# EAGLE design sch (EAGLE 8.4.0)
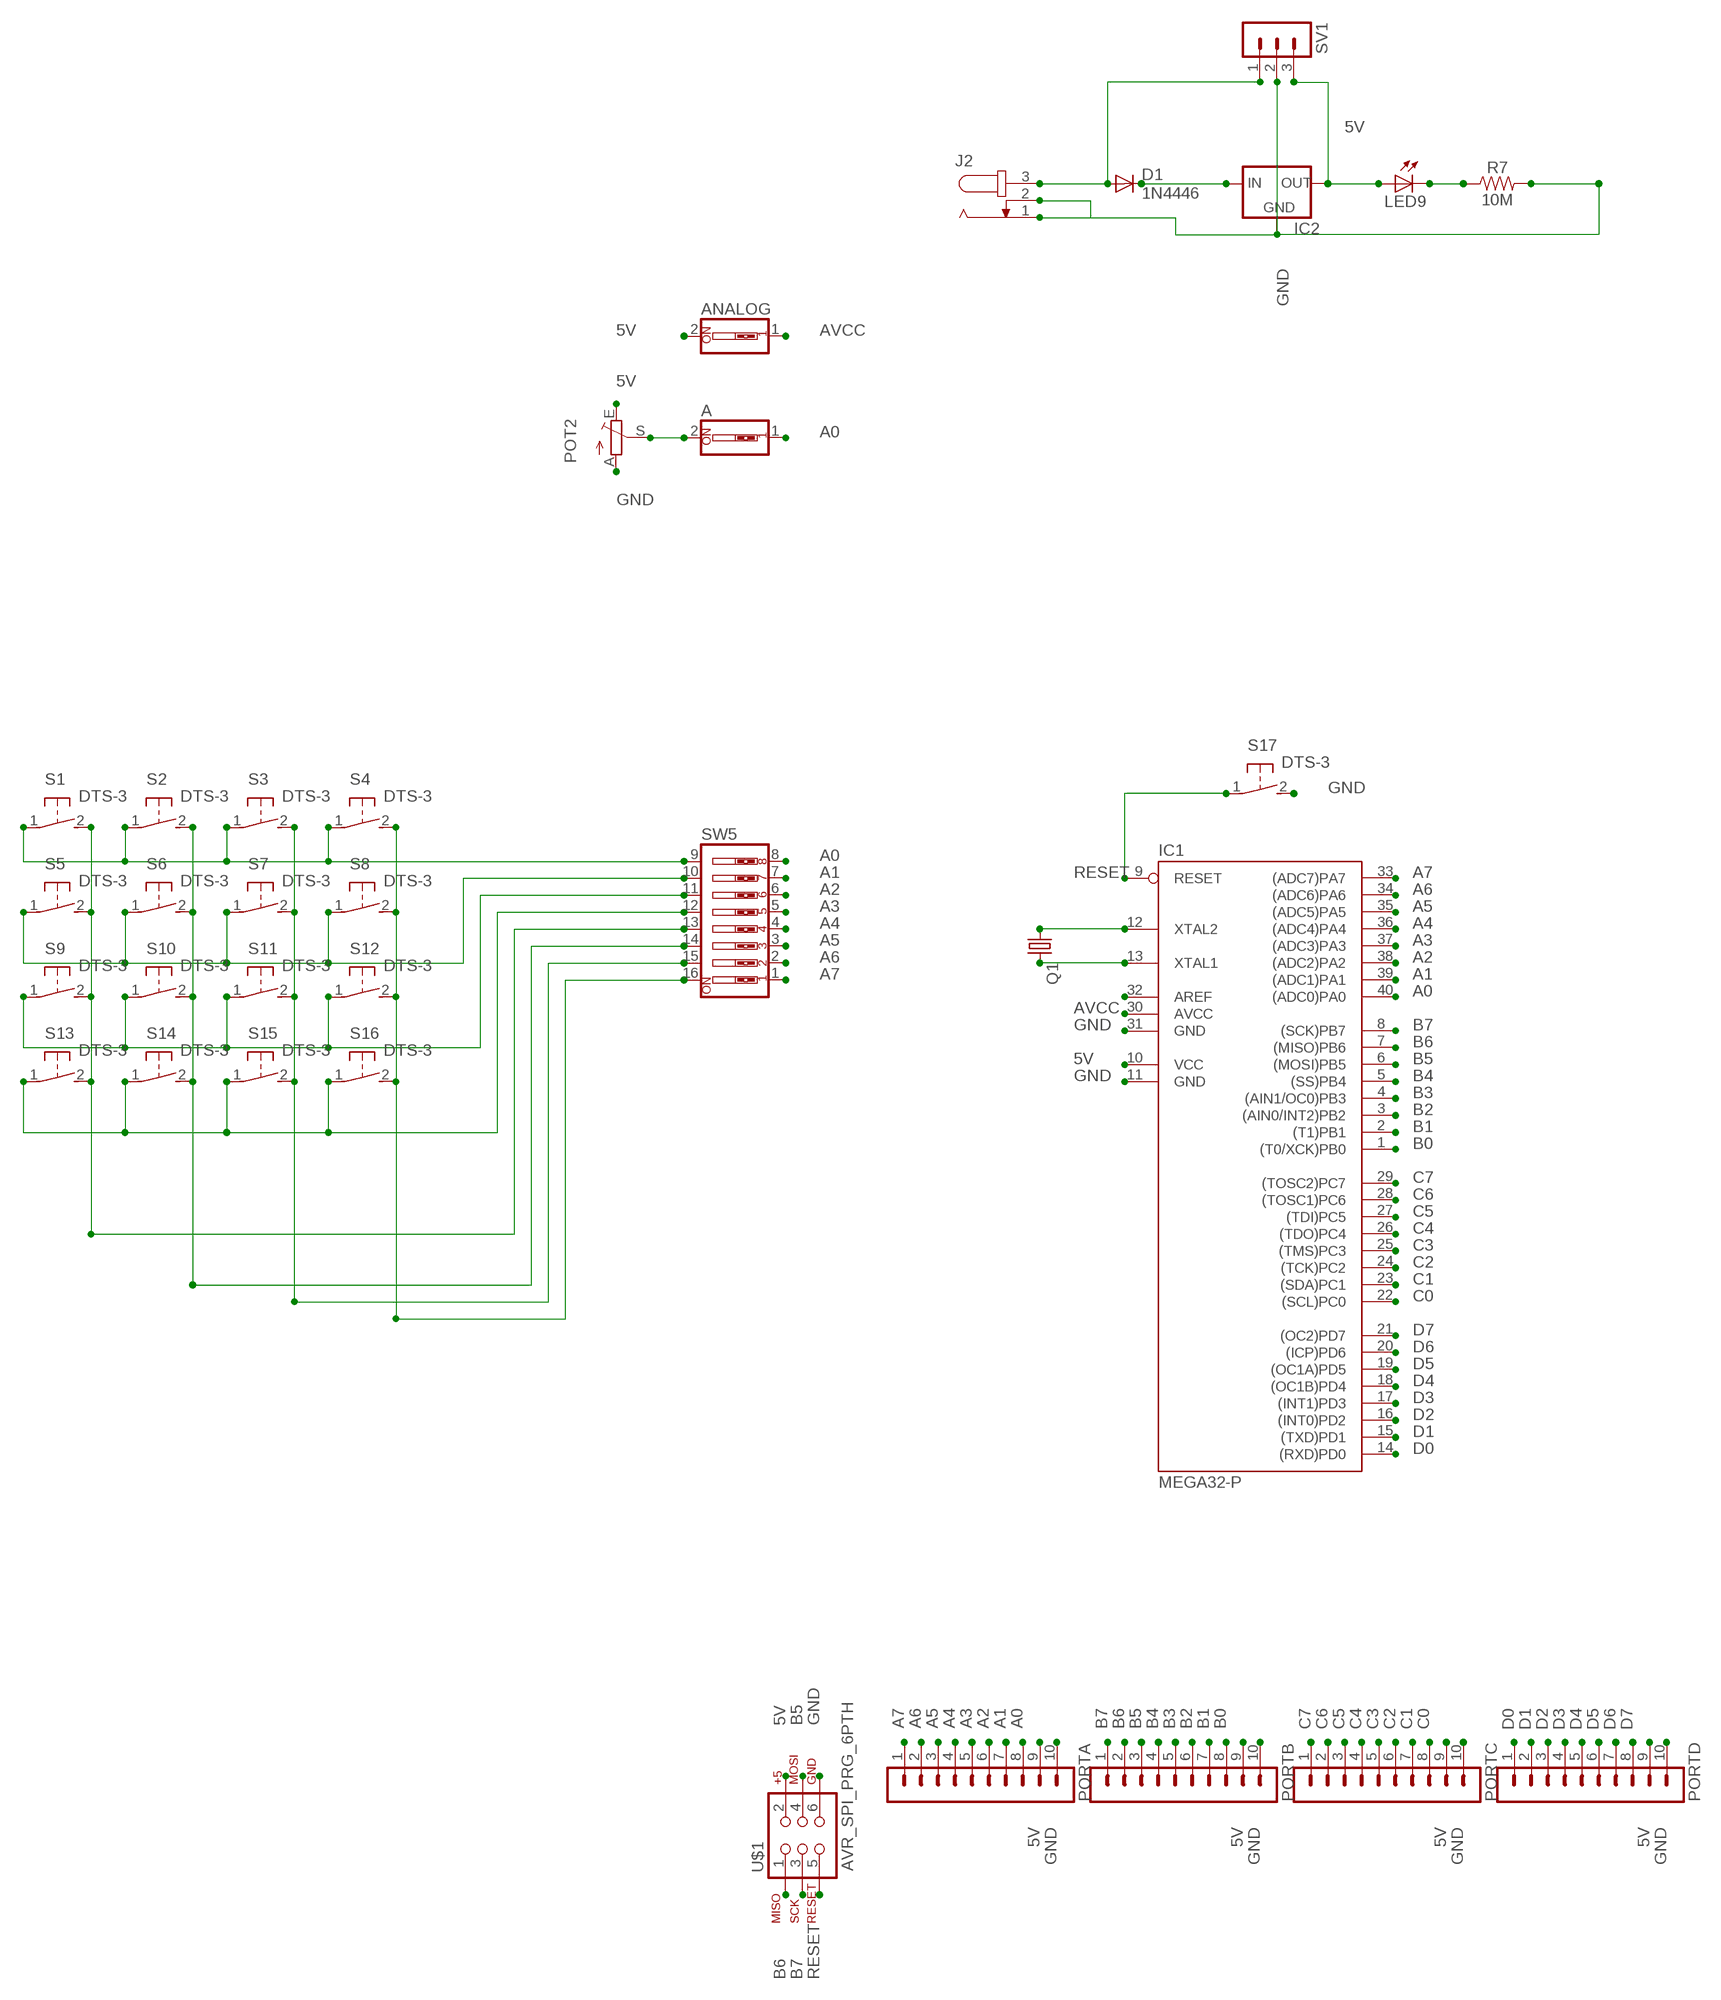
[diagram p0: schematic, sheet 1, part 1 of 2]
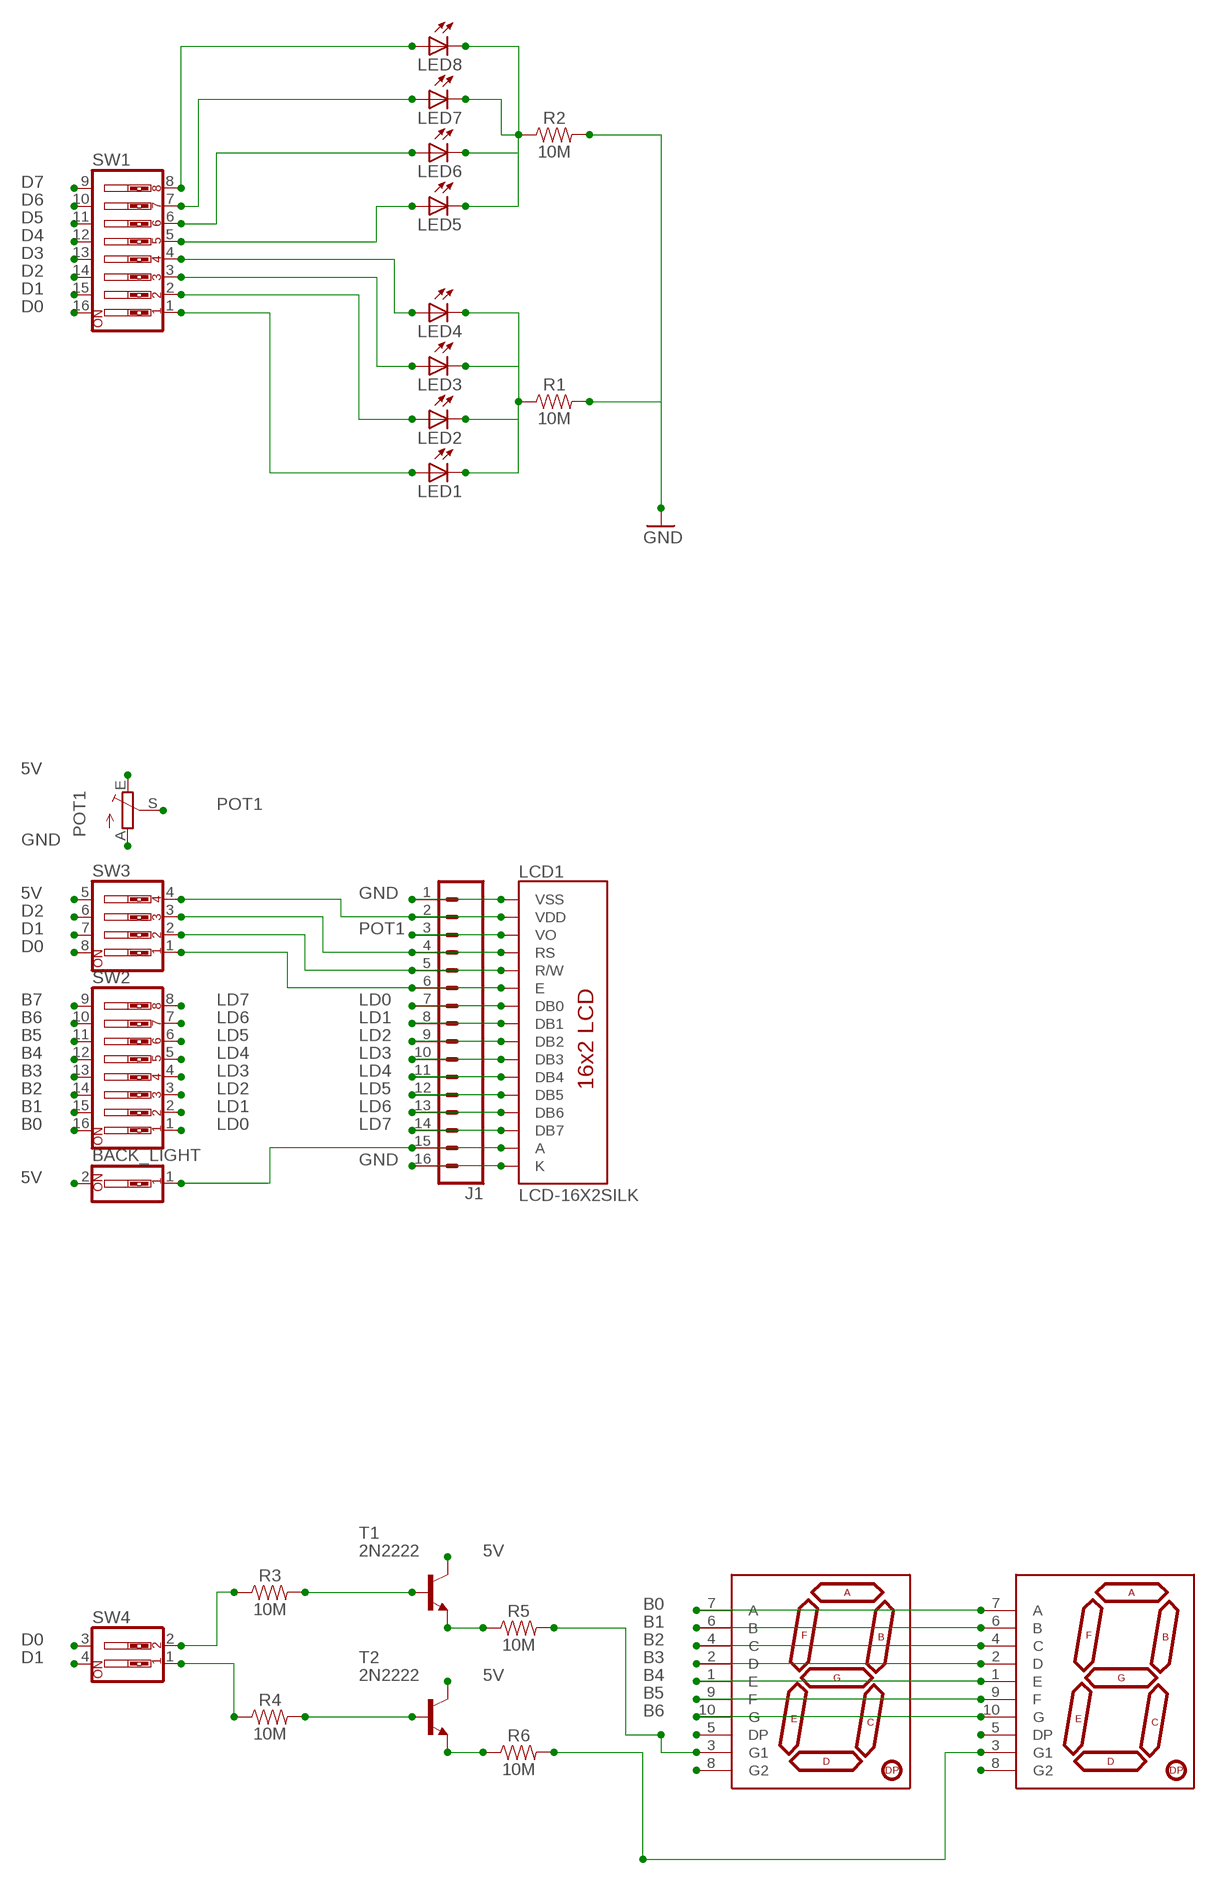
[diagram p1: schematic, sheet 1, part 2 of 2]

## Parts
A  SW_DIP-1  [EDG-01]
ANALOG  SW_DIP-1  [EDG-01]
BACK_LIGHT  SW_DIP-1  [EDG-01]
D1  1N4446  [DO35-10]
IC1  MEGA32-P  [DIL40]
IC2  78MXXL  [78MXXL]
J1  CONN_16LONGPADS  [1X16_LONGPADS]
J2  JACK-PLUG0  [SPC4077]
LCD1  LCD-16X2SILK  [LCD-16X2]
LED1  LED5MM  [LED5MM]
LED2  LED5MM  [LED5MM]
LED3  LED5MM  [LED5MM]
LED4  LED5MM  [LED5MM]
LED5  LED5MM  [LED5MM]
LED6  LED5MM  [LED5MM]
LED7  LED5MM  [LED5MM]
LED8  LED5MM  [LED5MM]
LED9  LED5MM  [LED5MM]
PORTA  MA10-1  [MA10-1]
PORTB  MA10-1  [MA10-1]
PORTC  MA10-1  [MA10-1]
PORTD  MA10-1  [MA10-1]
POT1  TRIM_EU-B25P  [B25P]
POT2  TRIM_EU-B25P  [B25P]
Q1  CRYTALHC49U-V  [HC49U-V]
R1  10M  10MOHM-HORIZ-1/4W-5%  [AXIAL-0.3]
R2  10M  10MOHM-HORIZ-1/4W-5%  [AXIAL-0.3]
R3  10M  10MOHM-HORIZ-1/4W-5%  [AXIAL-0.3]
R4  10M  10MOHM-HORIZ-1/4W-5%  [AXIAL-0.3]
R5  10M  10MOHM-HORIZ-1/4W-5%  [AXIAL-0.3]
R6  10M  10MOHM-HORIZ-1/4W-5%  [AXIAL-0.3]
R7  10M  10MOHM-HORIZ-1/4W-5%  [AXIAL-0.3]
S1  DTS-3  [DTS-3]
S2  DTS-3  [DTS-3]
S3  DTS-3  [DTS-3]
S4  DTS-3  [DTS-3]
S5  DTS-3  [DTS-3]
S6  DTS-3  [DTS-3]
S7  DTS-3  [DTS-3]
S8  DTS-3  [DTS-3]
S9  DTS-3  [DTS-3]
S10  DTS-3  [DTS-3]
S11  DTS-3  [DTS-3]
S12  DTS-3  [DTS-3]
S13  DTS-3  [DTS-3]
S14  DTS-3  [DTS-3]
S15  DTS-3  [DTS-3]
S16  DTS-3  [DTS-3]
S17  DTS-3  [DTS-3]
SV1  MA03-1  [MA03-1]
SW1  SW_DIP-8  [EDG-08]
SW2  SW_DIP-8  [EDG-08]
SW3  SW_DIP-4  [EDG-04]
SW4  SW_DIP-2  [DIPSWITCH-02]
SW5  SW_DIP-8  [EDG-08]
T1  2N2222  [TO92-EBC-OVAL]
T2  2N2222  [TO92-EBC-OVAL]
U$1  AVR_SPI_PRG_6PTH  [2X3]
U$2  YSD-160AB3C-8  7-SEGMENT-1DIGIT-1INCH-BLUE-EZ  [7-SEGMENT-1"PTH-EZ]
U$3  YSD-160AB3C-8  7-SEGMENT-1DIGIT-1INCH-BLUE-EZ  [7-SEGMENT-1"PTH-EZ]

## Nets
5V: ANALOG.2 BACK_LIGHT.2 IC1.10(VCC) IC2.OUT LED9.A PORTA.9 PORTB.9 PORTC.9 PORTD.9 POT1.E POT2.E SV1.3 SW3.5 T1.C T2.C U$1.2
A0: A.1 IC1.40((ADC0)PA0) PORTA.8 SW5.8
A1: IC1.39((ADC1)PA1) PORTA.7 SW5.7
A2: IC1.38((ADC2)PA2) PORTA.6 SW5.6
A3: IC1.37((ADC3)PA3) PORTA.5 SW5.5
A4: IC1.36((ADC4)PA4) PORTA.4 SW5.4
A5: IC1.35((ADC5)PA5) PORTA.3 SW5.3
A6: IC1.34((ADC6)PA6) PORTA.2 SW5.2
A7: IC1.33((ADC7)PA7) PORTA.1 SW5.1
AVCC: ANALOG.1 IC1.30(AVCC)
B0: IC1.1((T0/XCK)PB0) PORTB.8 SW2.16 U$2.7(A) U$3.7(A)
B1: IC1.2((T1)PB1) PORTB.7 SW2.15 U$2.6(B) U$3.6(B)
B2: IC1.3((AIN0/INT2)PB2) PORTB.6 SW2.14 U$2.4(C) U$3.4(C)
B3: IC1.4((AIN1/OC0)PB3) PORTB.5 SW2.13 U$2.2(D) U$3.2(D)
B4: IC1.5((SS)PB4) PORTB.4 SW2.12 U$2.1(E) U$3.1(E)
B5: IC1.6((MOSI)PB5) PORTB.3 SW2.11 U$1.4 U$2.9(F) U$3.9(F)
B6: IC1.7((MISO)PB6) PORTB.2 SW2.10 U$1.1 U$2.10(G) U$3.10(G)
B7: IC1.8((SCK)PB7) PORTB.1 SW2.9 U$1.3
C0: IC1.22((SCL)PC0) PORTC.8
C1: IC1.23((SDA)PC1) PORTC.7
C2: IC1.24((TCK)PC2) PORTC.6
C3: IC1.25((TMS)PC3) PORTC.5
C4: IC1.26((TDO)PC4) PORTC.4
C5: IC1.27((TDI)PC5) PORTC.3
C6: IC1.28((TOSC1)PC6) PORTC.2
C7: IC1.29((TOSC2)PC7) PORTC.1
D0: IC1.14((RXD)PD0) PORTD.1 SW1.16 SW3.8 SW4.3
D1: IC1.15((TXD)PD1) PORTD.2 SW1.15 SW3.7 SW4.4
D2: IC1.16((INT0)PD2) PORTD.3 SW1.14 SW3.6
D3: IC1.17((INT1)PD3) PORTD.4 SW1.13
D4: IC1.18((OC1B)PD4) PORTD.5 SW1.12
D5: IC1.19((OC1A)PD5) PORTD.6 SW1.11
D6: IC1.20((ICP)PD6) PORTD.7 SW1.10
D7: IC1.21((OC2)PD7) PORTD.8 SW1.9
GDHJH: R4.P$1 SW4.1
GFHGV: R3.P$1 SW4.2
GND: IC1.11(GND) IC1.31(GND) IC2.GND J1.1 J1.16 J2.1 J2.2 LCD1.1(VSS) LCD1.16(K) PORTA.10 PORTB.10 PORTC.10 PORTD.10 POT1.A POT2.A R1.P$2 R2.P$2 R7.P$2 S17.2 SV1.2 U$1.6
LD0: J1.7 LCD1.7(DB0) SW2.1
LD1: J1.8 LCD1.8(DB1) SW2.2
LD2: J1.9 LCD1.9(DB2) SW2.3
LD3: J1.10 LCD1.10(DB3) SW2.4
LD4: J1.11 LCD1.11(DB4) SW2.5
LD5: J1.12 LCD1.12(DB5) SW2.6
LD6: J1.13 LCD1.13(DB6) SW2.7
LD7: J1.14 LCD1.14(DB7) SW2.8
N$1: LED1.K(C) LED2.K(C) LED3.K(C) LED4.K(C) R1.P$1
N$2: U$2.8(G2)
N$3: R6.P$2 U$3.3(G1)
N$4: R3.P$2 T1.B
N$5: J1.4 LCD1.4(RS) SW3.3
N$6: J1.5 LCD1.5(R/W) SW3.2
N$7: J1.6 LCD1.6(E) SW3.1
N$8: LED5.K(C) LED6.K(C) LED7.K(C) LED8.K(C) R2.P$1
N$9: D1.A J2.3 SV1.1
N$10: R5.P$1 T1.E
N$11: R6.P$1 T2.E
N$12: S1.2 S5.2 S9.2 S13.2 SW5.13
N$13: U$3.5(DP)
N$14: IC1.13(XTAL1) Q1.2
N$15: U$3.8(G2)
N$16: R4.P$2 T2.B
N$17: LED8.A SW1.8
N$18: LED7.A SW1.7
N$19: LED6.A SW1.6
N$20: LED5.A SW1.5
N$21: LED4.A SW1.4
N$22: LED3.A SW1.3
N$23: LED2.A SW1.2
N$24: LED1.A SW1.1
N$25: BACK_LIGHT.1 J1.15 LCD1.15(A)
N$27: S2.2 S6.2 S10.2 S14.2 SW5.14
N$28: R5.P$2 U$2.3(G1)
N$29: A.2 POT2.S
N$30: S3.2 S7.2 S11.2 S15.2 SW5.15
N$31: S1.1 S2.1 S3.1 S4.1 SW5.9
N$32: U$2.5(DP)
N$33: D1.C IC2.IN
N$34: S4.2 S8.2 S12.2 S16.2 SW5.16
N$35: IC1.12(XTAL2) Q1.1
N$36: IC1.32(AREF)
N$39: LED9.K(C) R7.P$1
N$41: S5.1 S6.1 S7.1 S8.1 SW5.10
N$49: S9.1 S10.1 S11.1 S12.1 SW5.11
N$57: S13.1 S14.1 S15.1 S16.1 SW5.12
POT1: J1.3 LCD1.3(VO) POT1.S
RESET: IC1.9(RESET) S17.1 U$1.5
RRR: J1.2 LCD1.2(VDD) SW3.4

## Library data of the parts
A ANALOG BACK_LIGHT = special:SW_DIP-1: DIP SWITCH
D1 = diode:1N4446: DIODE high speed (Philips)
IC1 = atmel:MEGA32-P: MICROCONTROLLER 32 Kbytes FLASH 2 Kbytes SRAM 1 Kbytes EEPROM USART 8-channel 10 bit ADC Source: www.atmel.com .. doc2503.pdf; MPN: ATMEGA32-16PU; OC_FARNELL: 1661729; OC_NEWARK: 51P1794
IC2 = v-reg:78MXXL: VOLTAGE REGULATOR
J1 = SparkFun-Connectors:CONN_16: Multi connection point. Often used as Generic Header-pin footprint for 0.1 inch spaced/style header connections On any of the 0.1 inch spaced packages, you can populate with these: Break Away Headers - Straight <https://www.sparkfun.com/products/116> (PRT-00116) Break Away Male Headers - Right Angle <https://www.sparkfun.com/products/553> (PRT-00553) Female Headers <https://www.sparkfun.com/products/115> (PRT-00115) Break Away Headers - Machine Pin <https://www.sparkfun.com/products/117> (PRT-00117) Break Away Female Headers - Swiss Machine Pin <https://www.sparkfun.com/products/743> (PRT-00743) For SCREWTERMINALS and SPRING TERMINALS visit here: Screw Terimnals on SparkFun.com <https://www.sparkfun.com/search/results?term=Screw+Terminals> (5mm/3.5mm/2.54mm spacing) This device is also useful as a general connection point to wire up your design to another part of your project. Our various solder wires solder well into these plated through hole pads. Hook-Up Wire - Assortment (Stranded, 22 AWG) <https://www.sparkfun.com/products/11375> (PRT-11375) Hook-Up Wire - Assortment (Solid Core, 22 AWG) <https://www.sparkfun.com/products/11367> (PRT-11367) View the entire wire category on our website here <https://www.sparkfun.com/categories/141> Special notes: Molex polarized connector foot print use with SKU : PRT-08231 with associated crimp pins and housings. 1MM SMD Version SKU: PRT-10208 NOTES ON THE VARIANTS LOCK and LOCK_LONGPADS... This footprint was designed to help hold the alignment of a through-hole component (i.e. 6-pin header) while soldering it into place. You may notice that each hole has been shifted either up or down by 0.005 of an inch from it's more standard position (which is a perfectly straight line). This slight alteration caused the pins (the squares in the middle) to touch the edges of the holes. Because they are alternating, it causes a "brace" to hold the component in place. 0.005 has proven to be the perfect amount of "off-center" position when using our standard breakaway headers. Although looks a little odd when you look at the bare footprint, once you have a header in there, the alteration is very hard to notice. Also,if you push a header all the way into place, it is covered up entirely on the bottom side.
J2 = con-jack:JACK-PLUG: DC POWER JACK Power Jack, DC, Right Angle, Through Hole, Rated 5A at 16VDC, PC Terminals Distributor: Farnell (www.Farnell.de) Drawing: 84N1161.pdf / 84N1162.pdf Manufacturer: SPC Technology (www.spctechnology.com) Type: SPC4077 / SPC 4078; OC_FARNELL: unknown; OC_NEWARK: unknown
LCD1 = SparkFun-Displays:LCD-16X2: Standard text-only 16x2 parallel input LCD Basic 16 character by 2 line display. Typically utilizes the extremely common HD44780 parallel interface chipset SparkFun Products: Basic 16x2 Green <https://www.sparkfun.com/products/255> Basic 8x2 Green <https://www.sparkfun.com/products/11122>; SF_ID: LCD-00255
LED1-LED9 = led:LED: LED OSRAM: - CHIPLED LG R971, LG N971, LY N971, LG Q971, LY Q971, LO R971, LY R971 LH N974, LH R974 LS Q976, LO Q976, LY Q976 LO Q996 - Hyper CHIPLED LW Q18S LB Q993, LB Q99A, LB R99A - SideLED LS A670, LO A670, LY A670, LG A670, LP A670 LB A673, LV A673, LT A673, LW A673 LH A674 LY A675 LS A676, LA A676, LO A676, LY A676, LW A676 LS A679, LY A679, LG A679 - Hyper Micro SIDELED® LS Y876, LA Y876, LO Y876, LY Y876 LT Y87S - SmartLED LW L88C, LW L88S LB L89C, LB L89S, LG L890 LS L89K, LO L89K, LY L89K LS L896, LA L896, LO L896, LY L896 - TOPLED LS T670, LO T670, LY T670, LG T670, LP T670 LSG T670, LSP T670, LSY T670, LOP T670, LYG T670 LG T671, LOG T671, LSG T671 LB T673, LV T673, LT T673, LW T673 LH T674 LS T676, LA T676, LO T676, LY T676, LB T676, LH T676, LSB T676, LW T676 LB T67C, LV T67C, LT T67C, LS T67K, LO T67K, LY T67K, LW E67C LS E67B, LA E67B, LO E67B, LY E67B, LB E67C, LV E67C, LT E67C LW T67C LS T679, LY T679, LG T679 LS T770, LO T770, LY T770, LG T770, LP T770 LB T773, LV T773, LT T773, LW T773 LH T774 LS E675, LA E675, LY E675, LS T675 LS T776, LA T776, LO T776, LY T776, LB T776 LHGB T686 LT T68C, LB T68C - Hyper Mini TOPLED® LB M676 - Mini TOPLED Santana® LG M470 LS M47K, LO M47K, LY M47K Source: http://www.osram.convergy.de/
PORTA PORTB PORTC PORTD = con-lstb:MA10-1: PIN HEADER; OC_FARNELL: unknown; OC_NEWARK: unknown
POT1 POT2 = pot:TRIM_EU-: POTENTIOMETER
Q1 = crystal:CRYTAL: CRYSTAL
R1-R7 = SparkFun-Resistors:10MOHM: RES-09327; PROD_ID: RES-09327
S1-S17 = switch-tact:DTS-3
SV1 = con-lstb:MA03-1: PIN HEADER; OC_FARNELL: unknown; OC_NEWARK: unknown
SW1 SW2 SW5 = special:SW_DIP-8: DIP SWITCH
SW3 = special:SW_DIP-4: DIP SWITCH
SW4 = SparkFun:SW_DIP-2: DIP SWITCH
T1 T2 = adafruit:2N2222: NPN TRANSISTOR Big oval pads
U$1 = SparkFun:AVR_SPI_PRG_6: AVR ISP 6 Pin This is the reduced ISP connector for AVR programming. Common on Arduino. This footprint will take up less PCB space and can be used with a 10-pin to 6-pin adapter such as SKU: BOB-08508
U$2 U$3 = SparkFun-LED:7-SEGMENT-1DIGIT-1INCH: 7-Segment Display, single digit, 1" EZ is for kits. Pads are only exposed on the bottom side to help prevent soldering in upside down. Datasheet (Red) <https://cdn.sparkfun.com/datasheets/Components/LED/YSD-160AR4B-8.pdf> Datasheet (Blue) <https://cdn.sparkfun.com/datasheets/Components/LED/YSD-160AB3C-8.pdf> SparkFun Products 7-Segment Display - LED (Red) <https://www.sparkfun.com/products/8546> (COM-08546) 7-Segment Display - LED (Blue) <https://www.sparkfun.com/products/9191> (COM-09191); PROD_ID: COMP-09495

## Board
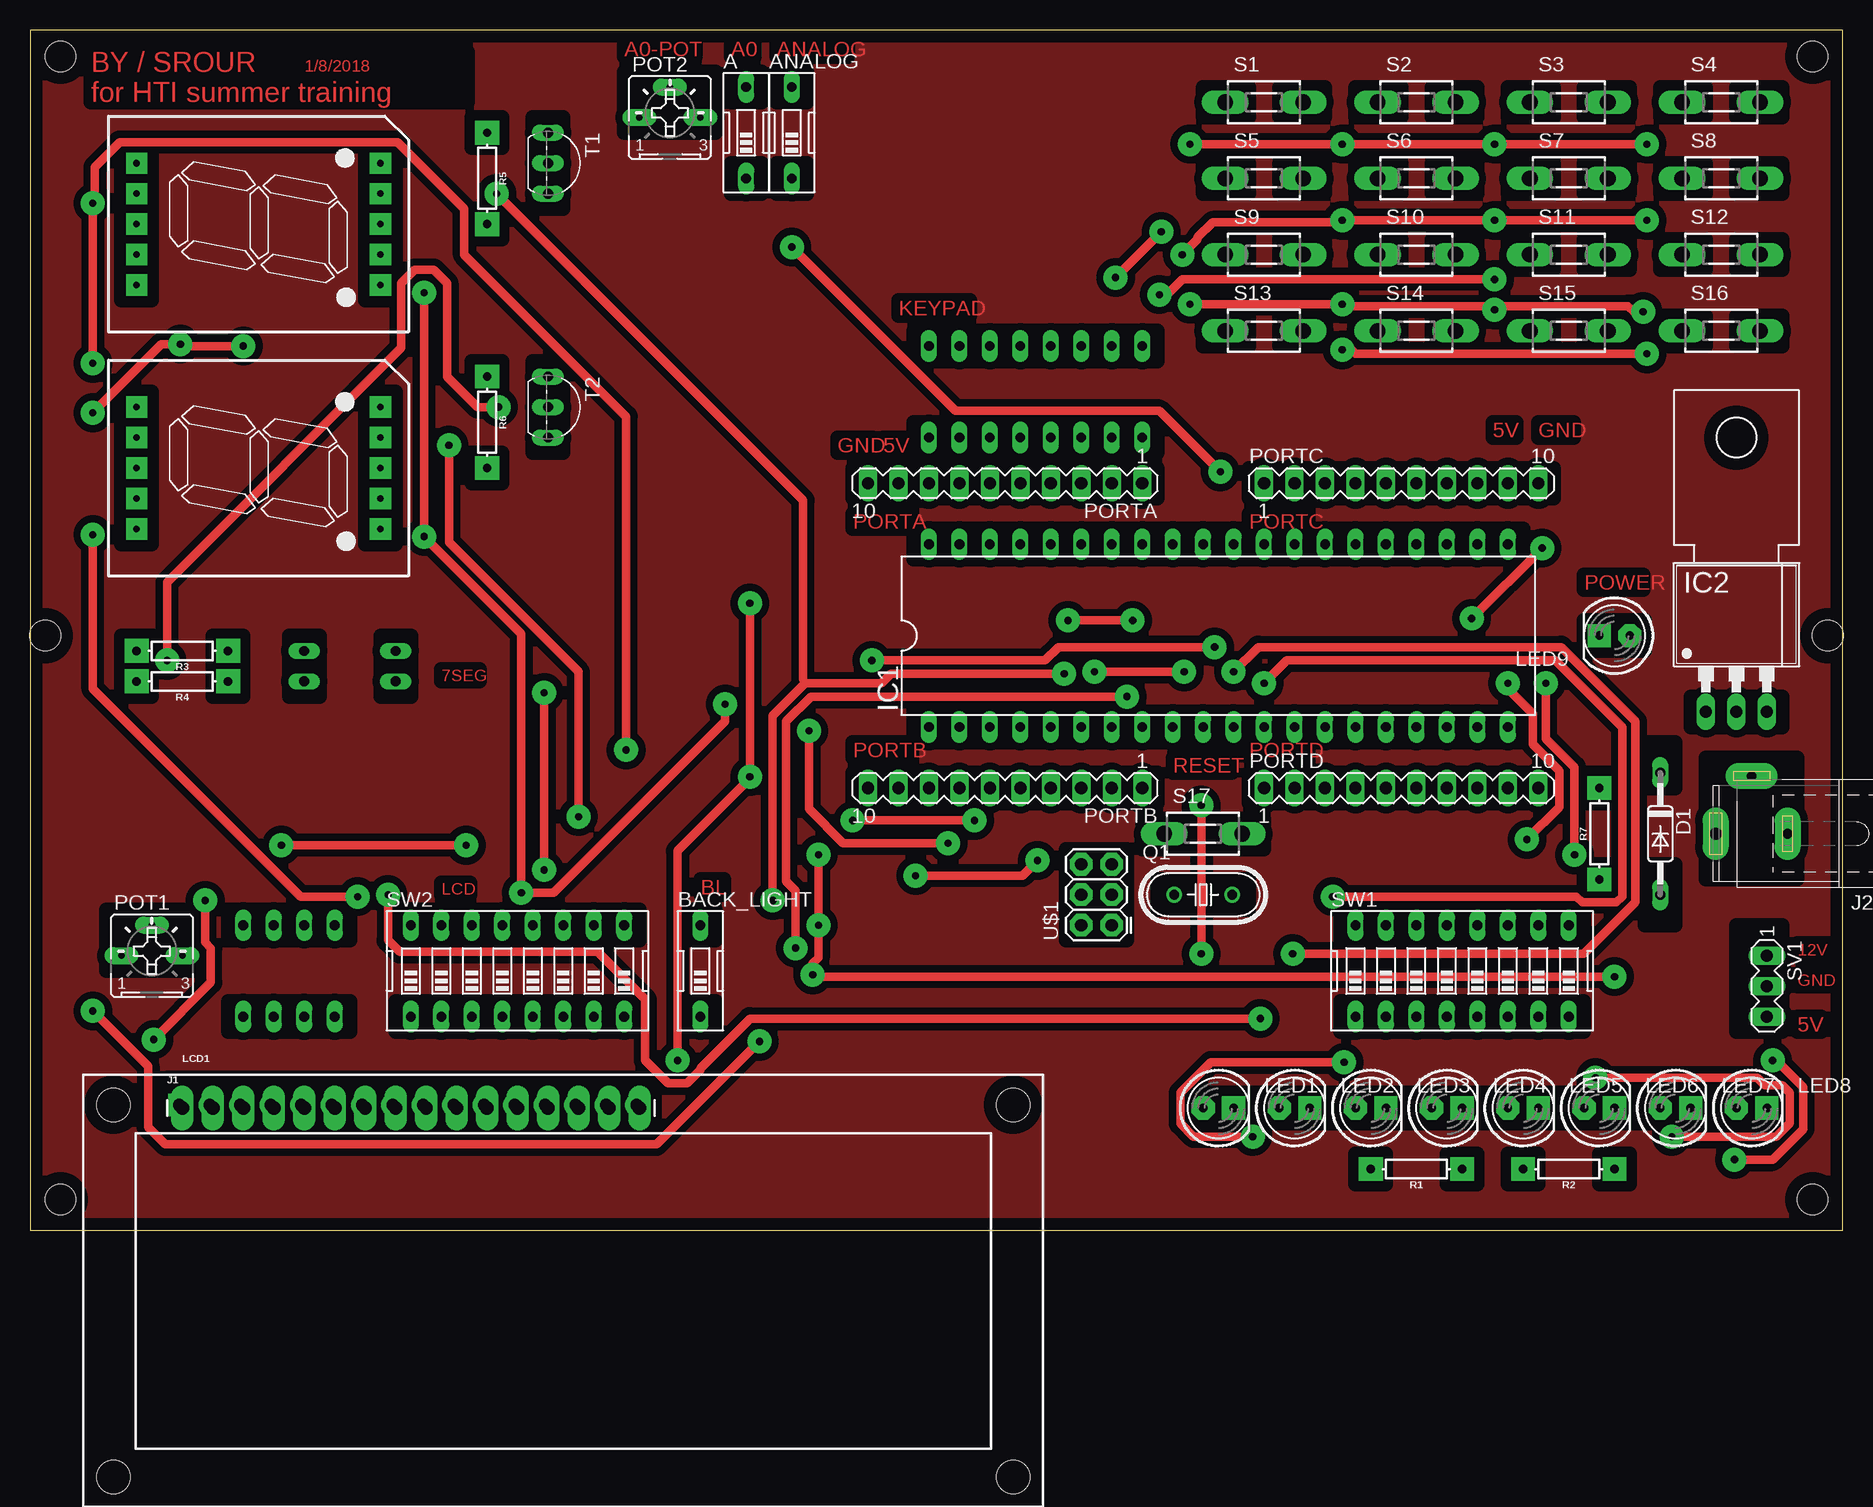
[diagram p2: board, top side]
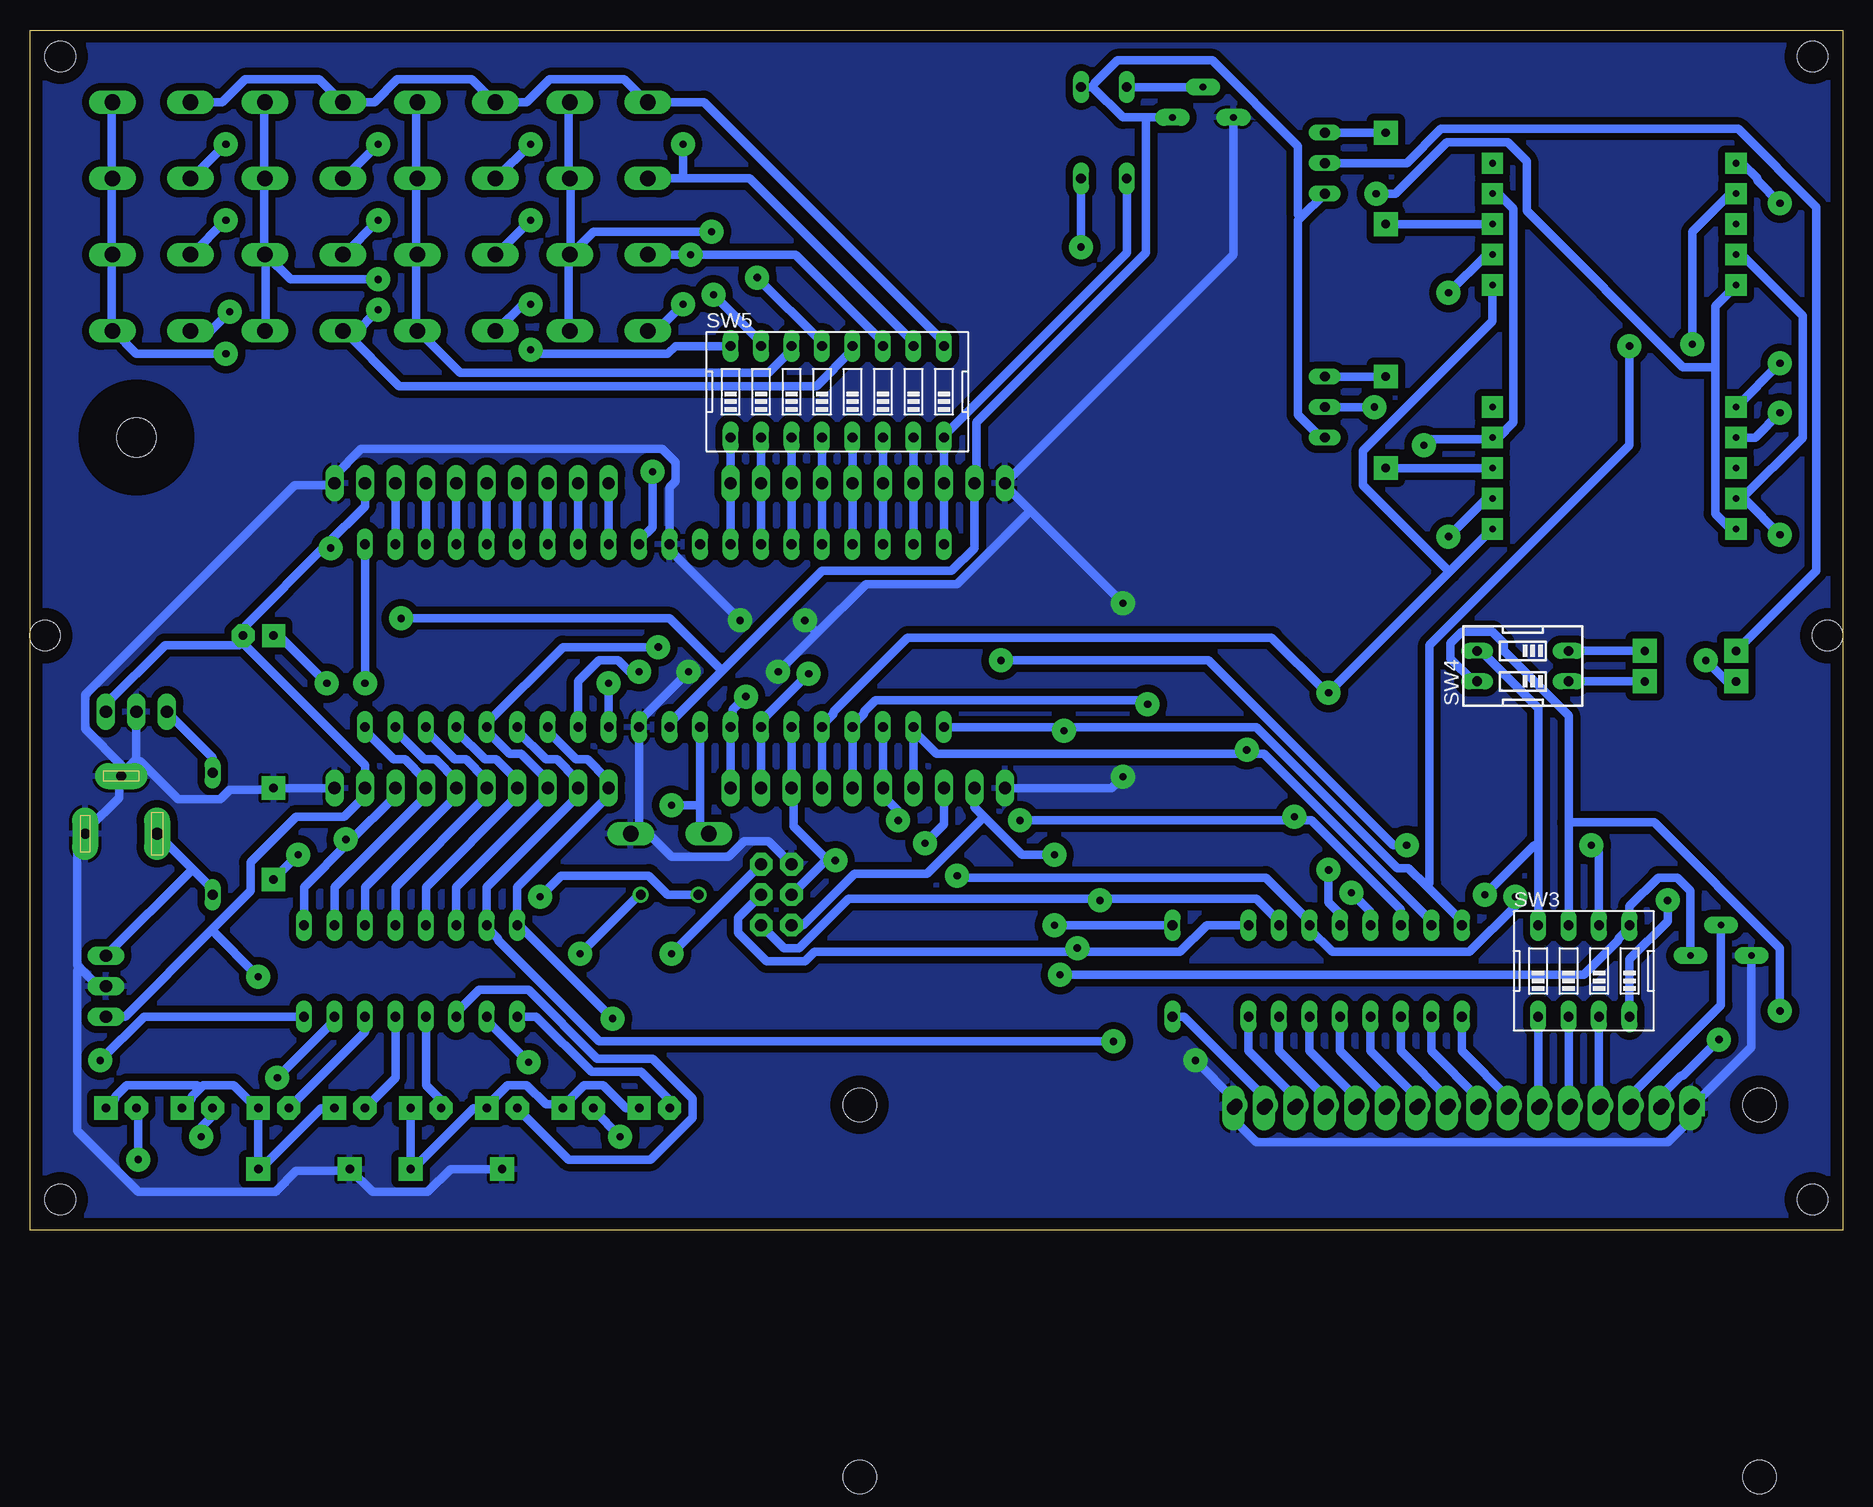
[diagram p3: board, bottom side, seen from below]

Size 151.11 x 100 mm. Coordinates in mm from the lower left corner, seen from the top.
Outline: 0,0 151.11,0 151.11,100 0,100 0,0
Copper layers (1*16): Top 0.035mm / dielectric 1.5mm / Bottom 0.035mm
Design rules "default *": minimum track width 0.7mm, minimum drill 0.6mm, track to track 0.4mm, track to pad 0.5mm, pad to pad 0.5mm, via to via 0.5mm, smd to smd 6mil, copper to edge 40mil, drill to drill 6mil, minimum pad ring 10mil, minimum via ring 0.7mm, stop-mask expansion 4mil, vias tented up to drill 0mil, thermal gap 10mil
Holes 2.54 mm at 2.54,97.79 148.59,97.79 148.59,2.54 2.54,2.54 149.86,49.53 1.27,49.53
tRestrict: area 73.7,55.9 to 124.5,58.4; area 73.7,40.6 to 124.5,43.2; area 68.6,61 to 94,63.5; area 101.6,61 to 127,63.5; area 68.6,35.6 to 94,38.1; area 101.6,35.6 to 127,38.1; area 73.7,72.4 to 94,74.9; area 73.7,64.8 to 94,67.3; area 138.4,41.9 to 146.1,44.5; area 139.7,29.2 to 147.3,39.4; area 142.2,16.5 to 146.1,25.4; area 134.6,36.8 to 137.2,40.6; 75 more areas
vRestrict: area 137.2,47 to 147.3,69.8; area 92.7,25.4 to 102.9,30.5; area 6.4,74.9 to 31.8,92.7; area 6.4,54.6 to 31.8,72.4; area 72.4,64.8 to 95.2,74.9; area 49.5,88.9 to 57.2,96.5; area 57.1,86.4 to 66,96.5; area 40.6,85.1 to 47,92.7; area 40.6,64.8 to 47,72.4; area 21.6,43.2 to 31.8,50.8; area 6.3,19 to 14,26.7; area 15.2,16.5 to 27.9,26.7; 32 more areas

### Footprints (pad centres in the part's own frame; a part is rotated, then mirrored left to right if it is on the bottom)
EDG-01 = drill 0.813 long: 1 0,-3.81; 2 0,3.81
DO35-10 = drill 0.813 long: A 5.08,0; C -5.08,0
DIL40 = drill 0.813 long: 1 -24.13,-7.62; 2 -21.59,-7.62; 3 -19.05,-7.62; 4 -16.51,-7.62; 5 -13.97,-7.62; 6 -11.43,-7.62; 7 -8.89,-7.62; 8 -6.35,-7.62; 9 -3.81,-7.62; 10 -1.27,-7.62; 11 1.27,-7.62; 12 3.81,-7.62; 13 6.35,-7.62; 14 8.89,-7.62; 15 11.43,-7.62; 16 13.97,-7.62; 17 16.51,-7.62; 18 19.05,-7.62; 19 21.59,-7.62; 20 24.13,-7.62; 21 24.13,7.62; 22 21.59,7.62; 23 19.05,7.62; 24 16.51,7.62; 25 13.97,7.62; 26 11.43,7.62; 27 8.89,7.62; 28 6.35,7.62; 29 3.81,7.62; 30 1.27,7.62; 31 -1.27,7.62; 32 -3.81,7.62; 33 -6.35,7.62; 34 -8.89,7.62; 35 -11.43,7.62; 36 -13.97,7.62; 37 -16.51,7.62; 38 -19.05,7.62; 39 -21.59,7.62; 40 -24.13,7.62
78MXXL = drill 1.016 long: GND 0,-5.08; IN -2.54,-5.08; OUT 2.54,-5.08 | hole 3.302: 0,17.78
1X16_LONGPADS = drill 1.118 pad 1.88 long: 1 0,0; 2 2.54,0; 3 5.08,0; 4 7.62,0; 5 10.16,0; 6 12.7,0; 7 15.24,0; 8 17.78,0; 9 20.32,0; 10 22.86,0; 11 25.4,0; 12 27.94,0; 13 30.48,0; 14 33.02,0; 15 35.56,0; 16 38.1,0
SPC4077 = drill 0.8 pad 2.184 long: 1 -3,0; 2 0,-4.8 | drill 1 pad 2.184 long: 3 3,0
LCD-16X2 = drill 1.016 pad 1.88 square: 1 -32,15.5 | drill 1.016 pad 1.88: 2 -29.46,15.5; 3 -26.92,15.5; 4 -24.38,15.5; 5 -21.84,15.5; 6 -19.3,15.5; 7 -16.76,15.5; 8 -14.22,15.5; 9 -11.68,15.5; 10 -9.14,15.5; 11 -6.6,15.5; 12 -4.06,15.5; 13 -1.52,15.5; 14 1.02,15.5; 15 3.56,15.5; 16 6.1,15.5 | hole 2.8: -37.5,15.5; -37.5,-15.5; 37.5,15.5; 37.5,-15.5
LED5MM = drill 0.7 pad 1.93 octagon: A -1.27,0 | drill 0.7 pad 1.93 square: K 1.27,0
MA10-1 = drill 1.016 long: 1 -11.43,0; 2 -8.89,0; 3 -6.35,0; 4 -3.81,0; 5 -1.27,0; 6 1.27,0; 7 3.81,0; 8 6.35,0; 9 8.89,0; 10 11.43,0
B25P = drill 0.55 pad 1.422 long: A -2.54,0; E 2.54,0; S 0,2.54
HC49U-V = drill 0.813: 1 -2.413,0; 2 2.413,0
AXIAL-0.3 = drill 0.7 pad 1.981 square: P$1 -3.81,0; P$2 3.81,0
DTS-3 = drill 1.3 long: 1 -3.25,0; 2 3.25,0
MA03-1 = drill 1.016 long: 1 -2.54,0; 2 0,0; 3 2.54,0
EDG-08 = drill 0.813 long: 1 -8.89,-3.81; 2 -6.35,-3.81; 3 -3.81,-3.81; 4 -1.27,-3.81; 5 1.27,-3.81; 6 3.81,-3.81; 7 6.35,-3.81; 8 8.89,-3.81; 9 8.89,3.81; 10 6.35,3.81; 11 3.81,3.81; 12 1.27,3.81; 13 -1.27,3.81; 14 -3.81,3.81; 15 -6.35,3.81; 16 -8.89,3.81
EDG-04 = drill 0.813 long: 1 -3.81,-3.81; 2 -1.27,-3.81; 3 1.27,-3.81; 4 3.81,-3.81; 5 3.81,3.81; 6 1.27,3.81; 7 -1.27,3.81; 8 -3.81,3.81
DIPSWITCH-02 = drill 0.813 long: 1 -1.27,-3.81; 2 1.27,-3.81; 3 1.27,3.81; 4 -1.27,3.81
TO92-EBC-OVAL = drill 0.813 long: B 0,-1.27; C 2.54,-1.27; E -2.54,-1.27
2X3 = drill 1.016 pad 1.88 octagon: 1 0,0; 2 0,2.54; 3 2.54,0; 4 2.54,2.54; 5 5.08,0; 6 5.08,2.54
7-SEGMENT-1"PTH-EZ = drill 0.55 pad 1.778 square: 1 -5.08,-10.16; 2 -2.54,-10.16; 3 0,-10.16; 4 2.54,-10.16; 5 5.08,-10.16; 6 5.08,10.16; 7 2.54,10.16; 8 0,10.16; 9 -2.54,10.16; 10 -5.08,10.16

### Placement (x,y rotation side)
A  59.69,91.44 0 top
ANALOG  63.5,91.44 0 top
BACK_LIGHT  55.88,21.59 0 top
D1  135.89,33.02 270 top
IC1  99.06,49.53 0 top
IC2  142.24,48.26 0 top
J1  12.7,10.16 0 top
J2  143.51,33.02 180 top
LCD1  44.45,-5.08 0 top
LED1  99.06,10.16 0 top
LED2  105.41,10.16 0 top
LED3  111.76,10.16 0 top
LED4  118.11,10.16 0 top
LED5  124.46,10.16 0 top
LED6  130.81,10.16 0 top
LED7  137.16,10.16 0 top
LED8  143.51,10.16 0 top
LED9  132.08,49.53 180 top
PORTA  81.28,62.23 180 top
PORTB  81.28,36.83 180 top
PORTC  114.3,62.23 0 top
PORTD  114.3,36.83 0 top
POT1  10.16,22.86 0 top
POT2  53.34,92.71 0 top
Q1  97.79,27.94 0 top
R1  115.57,5.08 180 top
R2  128.27,5.08 180 top
R3  12.7,48.26 180 top
R4  12.7,45.72 180 top
R5  38.1,87.63 270 top
R6  38.1,67.31 270 top
R7  130.81,33.02 90 top
S1  102.87,93.98 0 top
S2  115.57,93.98 0 top
S3  128.27,93.98 0 top
S4  140.97,93.98 0 top
S5  102.87,87.63 0 top
S6  115.57,87.63 0 top
S7  128.27,87.63 0 top
S8  140.97,87.63 0 top
S9  102.87,81.28 0 top
S10  115.57,81.28 0 top
S11  128.27,81.28 0 top
S12  140.97,81.28 0 top
S13  102.87,74.93 0 top
S14  115.57,74.93 0 top
S15  128.27,74.93 0 top
S16  140.97,74.93 0 top
S17  97.79,33.02 0 top
SV1  144.78,20.32 270 top
SW1  119.38,21.59 0 top
SW2  40.64,21.59 0 top
SW3  21.59,21.59 0 bottom
SW4  26.67,46.99 90 bottom
SW5  83.82,69.85 0 bottom
T1  44.45,88.9 270 top
T2  44.45,68.58 270 top
U$1  90.17,25.4 90 top
U$2  19.05,83.82 90 top
U$3  19.05,63.5 90 top

### Tracks (layer width: path | path; a pad name or v marks a point on that pad's centre or on a via)
5V  (via drill 0.6)
  Top 0.7: v65.72,31.27 v65.72,25.4 65.72,22.7 65.25,22.23 v65.25,21.27 65.56,21.11 v132.08,21.11 | v120.17,50.96 v126.05,56.83
  Bottom 0.7: POT1.E 12.7,28.26 13.81,29.37 15.4,29.37 17.78,26.99 SW3.5 17.94,25.08 18.73,24.29 18.73,24.13 21.59,21.27 v65.25,21.27 | v65.72,25.4 BACK_LIGHT.2 | v65.72,31.27 68.42,31.27 71.6,34.45 | 71.6,34.45 72.39,35.24 PORTB.9 | U$1.2 86.68,25.4 82.39,29.69 76.36,29.69 71.6,34.45 | LED9.A 133.35,48.9 123.19,38.73 PORTD.9 123.35,36.51 123.35,36.04 124.94,34.45 128.91,34.45 132.72,30.64 132.72,28.26 135.97,25 | PORTC.9 123.19,60.33 126.44,57.07 | 126.44,57.07 133.19,50.32 133.19,49.85 LED9.A | SV1.3 143.19,17.78 135.97,25 | IC2.OUT 144.78,43.81 139.86,48.74 133.67,48.74 LED9.A | IC1.10 97.79,42.23 93.42,46.59 | 93.42,46.59 85.09,54.93 74.3,54.93 72.39,56.83 PORTA.9 72.23,62.55 72.23,67.31 58.1,81.44 58.1,92.71 | 62.55,95.25 ANALOG.2 | 62.55,95.25 60.01,92.71 58.1,92.71 | POT2.E 58.1,92.71 | T2.C 43.5,66.04 45.4,67.94 45.4,84.14 45.16,84.38 | T1.C 45.16,84.38 | 62.55,95.25 62.39,95.57 60.48,97.47 52.55,97.47 45.4,90.33 45.4,84.61 45.16,84.38 | v126.05,56.83 126.21,56.83 126.44,57.07 | v120.17,50.96 97.79,50.96 93.42,46.59 | 135.97,25 v132.08,21.11
A0
  Bottom 0.7: IC1.40 PORTA.8 SW5.8 74.77,66.36 59.69,81.44 A.1
A1
  Bottom 0.7: IC1.39 PORTA.7 SW5.7
A2
  Bottom 0.7: IC1.38 PORTA.6 SW5.6
A3
  Bottom 0.7: IC1.37 PORTA.5 SW5.5
A4
  Bottom 0.7: IC1.36 PORTA.4 SW5.4
A5
  Bottom 0.7: IC1.35 PORTA.3 SW5.3
A6
  Bottom 0.7: IC1.34 PORTA.2 SW5.2
A7
  Bottom 0.7: IC1.33 PORTA.1 SW5.1
AVCC  (via drill 0.6)
  Top 0.7: v63.5,81.92 77.15,68.26 94.14,68.26 v99.22,63.18
  Bottom 0.7: v63.5,81.92 ANALOG.1 | v99.22,63.18 99.22,58.58 100.33,57.47 IC1.30
B0  (via drill 0.6)
  Top 0.7: v5.24,68.1 10.95,73.82 v12.54,73.82 12.86,73.66 v17.78,73.66 | v76.52,32.23 67.79,32.23 64.93,35.08 v64.93,41.59
  Bottom 0.7: U$3.7 7.3,66.04 v5.24,68.1 | v12.54,73.82 12.54,83.19 9.37,86.36 U$2.7 | SW2.16 31.75,25.72 34.69,28.65 | 34.69,28.65 36.2,30.16 37.15,30.16 48.9,41.91 64.93,41.91 | IC1.1 64.93,41.91 | PORTB.8 74.93,33.81 v76.52,32.23 | v64.93,41.59 64.93,41.91 | v17.78,73.66 17.78,65.41 34.45,48.74 34.45,28.89 34.69,28.65
B1  (via drill 0.6)
  Top 0.7: v5.24,72.23 v5.24,85.57 5.4,85.88 5.4,88.58 7.46,90.65 30.64,90.65 36.2,85.09 36.2,81.28 49.69,67.79 v49.69,40.01
  Bottom 0.7: v5.24,72.23 U$3.6 | v5.24,85.57 7.14,87.47 7.14,87.63 8.41,88.9 U$2.6 | SW2.15 34.29,25.72 48.26,39.69 49.69,39.69 | 49.69,39.69 75.56,39.69 77.47,41.59 IC1.2 PORTB.7 | v49.69,40.01 49.69,39.69
B2  (via drill 0.6)
  Top 0.7: v78.74,34.13 v68.58,34.13 | v34.92,65.41 34.92,57.31 45.72,46.51 v45.72,34.45
  Bottom 0.7: U$2.4 28.73,86.36 27.46,85.09 27.46,67.31 28.73,66.04 U$3.4 29.53,65.88 34.45,65.88 v34.92,65.41 | SW2.14 36.83,26.67 44.29,34.13 45.72,34.13 | v68.58,34.13 45.72,34.13 | v78.74,34.13 78.74,34.92 80.01,36.2 PORTB.6 IC1.3 | v45.72,34.45 45.72,34.13
B3  (via drill 0.6)
  Top 0.7: v32.86,78.11 v32.86,57.78 40.96,49.69 v40.96,28.1 43.66,28.1 57.94,42.39 v57.94,43.81
  Bottom 0.7: PORTB.5 IC1.4 82.39,42.23 81.6,43.02 81.6,43.18 80.64,44.13 58.26,44.13 v57.94,43.81 | SW2.13 39.37,26.51 v40.96,28.1 | v32.86,57.78 29.69,60.96 U$3.2 | U$2.2 29.69,81.28 v32.86,78.11
B4  (via drill 0.6)
  Top 0.7: v42.86,44.77 v42.86,30
  Bottom 0.7: PORTB.4 IC1.5 84.93,42.23 84.14,43.02 84.14,43.18 77.95,49.37 47.62,49.37 43.18,44.93 v42.86,44.77 32.78,54.85 | SW2.12 41.91,26.35 42.86,27.3 v42.86,30 | U$3.1 32.78,54.85 | U$2.1 29.21,75.72 40.01,64.93 40.01,62.07 32.78,54.85
B5  (via drill 0.6)
  Top 0.7: v73.82,29.53 82.71,29.53 v83.98,30.8 | v5.24,57.94 5.24,45.09 22.54,27.78 v27.3,27.78
  Bottom 0.7: U$2.9 8.41,81.28 3.33,76.2 3.33,66.04 8.41,60.96 U$3.9 8.1,60.8 v5.24,57.94 | IC1.6 PORTB.3 87.47,36.51 87.47,33.66 84.93,31.11 v83.98,30.8 84.77,30.8 U$1.4 | v73.82,29.53 73.66,29.37 48.1,29.37 44.45,25.72 SW2.11 44.45,25.08 42.55,23.18 31.11,23.18 27.3,26.99 v27.3,27.78
B6  (via drill 0.6)
  Top 0.7: v86.2,46.35 71.75,46.35 70.96,45.56 64.61,45.56 | 64.61,45.56 61.91,42.86 v61.91,27.46 | v38.89,86.36 64.45,60.8 64.45,45.88 64.61,45.56
  Bottom 0.7: U$3.10 9.37,58.42 10.64,59.69 10.64,71.91 | 10.64,71.91 10.64,76.99 U$2.10 | PORTB.2 IC1.7 90.01,42.23 90.01,42.55 v86.2,46.35 | SW2.10 46.99,25.72 48.9,27.62 61.91,27.62 | 61.91,27.62 82.87,27.62 87,23.5 88.27,23.5 U$1.1 | v61.91,27.46 61.91,27.62 | 10.64,71.91 13.34,71.91 26.35,84.93 26.35,89.06 27.94,90.65 33.02,90.65 37.31,86.36 v38.89,86.36
B7  (via drill 0.6)
  Top 0.7: v91.44,44.45 65.09,44.45 63.02,42.39 63.02,29.05 63.82,28.26 v63.82,23.5
  Bottom 0.7: PORTB.1 IC1.8 92.55,42.23 92.55,43.34 v91.44,44.45 | SW2.9 53.02,25.4 55.24,23.18 63.82,23.18 | 63.82,23.18 85.72,23.18 86.52,22.38 89.69,22.38 92.08,24.77 92.08,26.04 U$1.3 | v63.82,23.5 63.82,23.18
C0
  Bottom 0.7: PORTC.8 IC1.22
C1
  Bottom 0.7: PORTC.7 IC1.23
C2
  Bottom 0.7: PORTC.6 IC1.24
C3
  Bottom 0.7: PORTC.5 IC1.25
C4
  Bottom 0.7: PORTC.4 IC1.26
C5
  Bottom 0.7: PORTC.3 IC1.27
C6
  Bottom 0.7: PORTC.2 IC1.28
C7
  Bottom 0.7: PORTC.1 IC1.29
D0  (via drill 0.6)
  Top 0.7: v102.55,17.62 60.01,17.62 55.88,13.49 55.88,13.34 54.77,12.22 53.18,12.22 51.28,14.13 51.28,19.21 47.31,23.18 30.8,23.18 29.84,24.13 v29.84,27.94
  Bottom 0.7: IC1.14 107.95,41.59 105.57,39.21 104.62,39.21 103.03,37.62 103.03,37.15 PORTD.1 102.87,36.2 110.49,28.57 SW1.16 110.17,25.24 v102.55,17.62 | 25.4,32.07 25.4,43.5 30.16,48.26 SW4.3 | 25.4,32.07 SW3.8 | v29.84,27.94 25.72,32.07 25.4,32.07
D1  (via drill 0.6)
  Top 0.7: v60.8,15.72 52.23,7.14 11.27,7.14 9.84,8.57 9.84,13.65 v5.24,18.26
  Bottom 0.7: IC1.15 110.49,41.59 108.11,39.21 107.16,39.21 105.57,37.62 105.57,37.15 PORTD.2 105.41,36.2 113.03,28.57 SW1.15 112.87,25.08 112.08,24.29 112.08,24.13 103.66,15.72 v60.8,15.72 | 22.86,33.97 22.86,42.86 28.26,48.26 28.26,48.9 29.21,49.85 31.75,49.85 32.7,48.9 32.7,47.62 30.8,45.72 SW4.4 | 22.86,33.97 SW3.7 | v5.24,18.26 5.24,23.5 15.72,33.97 22.86,33.97
D2  (via drill 0.6)
  Top 0.7: v36.35,32.07 v20.95,32.07 | v70.17,47.47 84.61,47.47 85.72,48.58 v98.74,48.58
  Bottom 0.7: SW1.14 115.57,28.57 107.95,36.2 PORTD.3 108.11,37.15 108.11,37.62 110.17,39.69 111.12,39.69 113.03,41.59 IC1.16 113.03,42.23 106.68,48.58 v98.74,48.58 | SW3.6 20.32,31.43 v20.95,32.07 | v36.35,32.07 37.47,32.07 52.86,47.47 v70.17,47.47
D3
  Bottom 0.7: SW1.13 118.11,28.57 110.49,36.2 PORTD.4 110.65,37.15 110.65,37.62 112.24,39.21 113.19,39.21 115.57,41.59 IC1.17
D4
  Bottom 0.7: SW1.12 120.65,28.57 113.03,36.2 PORTD.5 113.19,37.15 113.19,37.62 114.78,39.21 115.73,39.21 118.11,41.59 IC1.18
D5
  Bottom 0.7: IC1.19 120.65,41.59 118.27,39.21 117.32,39.21 115.57,37.47 PORTD.6 115.73,36.51 115.73,36.04 123.19,28.57 SW1.11
D6
  Bottom 0.7: SW1.10 125.73,28.57 118.11,36.2 PORTD.7 118.27,37.15 118.27,37.62 119.86,39.21 120.81,39.21 123.19,41.59 IC1.20
D7  (via drill 0.6)
  Top 0.7: v123.19,45.56 123.19,45.09 125.25,43.02 125.25,40.48 127.48,38.26 127.48,35.24 v124.78,32.54
  Bottom 0.7: SW1.9 128.27,28.57 124.54,32.31 | 124.54,32.31 120.65,36.2 PORTD.8 | v123.19,45.56 IC1.21 | v124.78,32.54 124.54,32.31
GDHJH
  Bottom 0.7: R4.P$1 SW4.1
GFHGV
  Bottom 0.7: R3.P$1 SW4.2
GND  (via drill 0.6)
  Top 0.7: v60.01,52.23 v60.01,37.78 59.85,37.47 53.98,31.59 v53.98,14.13 | v88.74,46.51 v96.2,46.51 | v86.52,50.8 v91.92,50.8
  Bottom 0.7: PORTD.10 R7.P$2 131.13,36.67 134.46,36.67 135.25,35.88 138.75,35.88 141.92,39.05 142.24,39.21 | 142.24,39.21 IC2.GND | 142.24,39.21 143.51,37.94 J2.2 | R1.P$2 116.05,5.08 117.95,3.17 122.56,3.17 R2.P$2 124.78,4.92 128.91,4.92 130.65,3.17 142.08,3.17 147.16,8.26 147.16,21.59 146.92,21.83 | SV1.2 145.41,20.32 146.92,21.83 | 146.92,21.83 147.16,22.07 147.16,32.38 146.53,33.02 J2.1 146.37,33.34 143.67,36.04 143.67,37.62 J2.2 | J2.2 143.35,38.58 146.53,41.75 146.53,44.61 129.06,62.07 126.05,62.07 PORTC.10 125.73,62.87 123.51,65.09 98.42,65.09 97.31,63.98 97.31,62.39 97.79,61.91 IC1.31 97.63,56.83 97.63,56.52 v91.92,50.8 | J1.16 50.64,10.32 LCD1.16 | POT1.A 7.62,15.24 J1.1 12.54,10.48 LCD1.1 12.86,9.84 12.86,9.05 14.61,7.3 48.9,7.3 50.64,9.05 50.64,9.84 LCD1.16 | U$1.6 89.53,32.38 91.6,32.38 92.87,31.11 97.63,31.11 100.01,33.5 S17.2 100.97,33.02 100.33,33.66 IC1.11 100.17,42.23 100.17,42.55 v96.2,46.51 | POT2.A 50.8,81.28 PORTA.10 69.69,61.91 67.71,59.93 | PORTB.10 60.96,36.83 v60.01,37.78 | 67.71,59.93 v60.01,52.23 | 85.49,49.77 81.44,53.82 73.82,53.82 67.71,59.93 | 85.49,49.77 v88.74,46.51 | v53.98,14.13 50.8,10.95 50.8,10.64 LCD1.16 | 85.49,49.77 v86.52,50.8
  pour Bottom (isolate 0.61): 0,100.33 151.13,100.33 151.13,0 0,0
LD0
  Bottom 0.7: SW2.1 31.75,14.92 27.78,10.95 27.78,10.48 LCD1.7 J1.7
LD1
  Bottom 0.7: SW2.2 34.29,14.92 30.32,10.95 30.32,10.48 LCD1.8 J1.8
LD2
  Bottom 0.7: SW2.3 36.83,14.92 32.86,10.95 32.86,10.48 LCD1.9 J1.9
LD3
  Bottom 0.7: SW2.4 39.37,14.92 35.4,10.95 35.4,10.48 LCD1.10 J1.10
LD4
  Bottom 0.7: SW2.5 41.91,14.92 37.94,10.95 37.94,10.48 LCD1.11 J1.11
LD5
  Bottom 0.7: SW2.6 44.45,14.92 40.48,10.95 40.48,10.48 LCD1.12 J1.12
LD6
  Bottom 0.7: SW2.7 46.99,14.92 43.02,10.95 43.02,10.48 LCD1.13 J1.13
LD7
  Bottom 0.7: SW2.8 49.53,14.92 45.56,10.95 45.56,10.48 LCD1.14 J1.14
N$1
  Bottom 0.7: LED1.K 101.44,10.16 103.35,12.06 104.93,12.06 106.68,10.32 LED2.K 107,10.48 108.11,10.48 109.7,12.06 111.28,12.06 112.87,10.48 LED3.K 114.14,10.16 119.22,5.08 R1.P$1 LED4.K
N$3
  Bottom 0.7: R6.P$2 U$3.3
N$4
  Bottom 0.7: T1.B 36.35,88.9 33.5,91.76 8.73,91.76 2.22,85.25 2.22,54.93 R3.P$2
N$5
  Bottom 0.7: SW3.3 J1.4 LCD1.4
N$6
  Bottom 0.7: SW3.2 J1.5 LCD1.5
N$7
  Bottom 0.7: SW3.1 J1.6 LCD1.6
N$8
  Bottom 0.7: LED5.K 126.84,10.16 131.92,5.08 R2.P$1 LED6.K 132.4,10.32 134.14,12.06 136.68,12.06 136.92,11.83 | LED7.K 137.64,10.95 137.64,11.11 136.92,11.83 | LED8.K 143.99,10.95 143.99,11.11 143.03,12.06 137.16,12.06 136.92,11.83
N$9
  Bottom 0.7: D1.A 135.89,28.42 137.56,30.08 | 137.56,30.08 140.49,33.02 J2.3 | 137.56,30.08 SV1.1
N$10
  Bottom 0.7: R5.P$1 T1.E
N$11
  Bottom 0.7: R6.P$1 T2.E
N$12  (via drill 0.6)
  Top 0.7: v94.3,83.19 v90.49,79.38
  Bottom 0.7: SW5.13 85.09,73.98 v90.49,79.38 | v94.3,83.19 104.14,83.19 106.05,81.28 S9.2 | S13.2 106.2,74.93 106.2,80.96 S9.2 | S9.2 106.05,81.76 106.05,87.63 S5.2 106.2,87.95 106.2,93.98 S1.2
N$14  (via drill 0.6)
  Top 0.7: v105.25,23.02 129.54,23.02 133.83,27.3 133.83,42.39 127.64,48.58 102.39,48.58 v100.33,46.51
  Bottom 0.7: v105.25,23.02 100.33,27.94 Q1.2 | v100.33,46.51 101.12,46.51 102.08,47.47 103.66,47.47 105.41,45.72 IC1.13
N$16  (via drill 0.6)
  Top 0.7: v39.05,68.58 37.31,68.58 34.77,71.12 34.77,78.9 33.66,80.01 32.07,80.01 30.96,78.9 30.96,73.5 11.43,53.98 v11.43,47.47
  Bottom 0.7: v39.05,68.58 T2.B | v11.43,47.47 9.68,45.72 R4.P$2
N$17  (via drill 0.6)
  Top 0.7: v145.26,14.13 145.57,14.13 147.8,11.91 147.8,8.41 145.26,5.87 v142.08,5.87
  Bottom 0.7: SW1.8 141.6,17.78 v145.26,14.13 | v142.08,5.87 142.08,10 LED8.A
N$18  (via drill 0.6)
  Top 0.7: v130.49,12.7 143.99,12.7 144.62,12.06 146.05,12.06 146.69,11.43 146.69,8.89 145.57,7.78 v136.84,7.78
  Bottom 0.7: SW1.7 125.73,17.46 v130.49,12.7 | v136.84,7.78 136.84,8.57 135.89,9.53 LED7.A
N$19
  Bottom 0.7: SW1.6 123.19,16.51 LED6.A
N$20
  Bottom 0.7: SW1.5 120.65,12.7 LED5.A
N$21
  Bottom 0.7: SW1.4 118.11,12.06 116.84,10.79 LED4.A
N$22
  Bottom 0.7: SW1.3 115.57,18.1 113.67,20 109.54,20 103.82,14.29 99.22,14.29 95.89,10.95 95.89,9.37 99.38,5.87 106.2,5.87 LED3.A
N$23  (via drill 0.6)
  Top 0.7: v109.54,13.97 98.42,13.97 95.89,11.43 95.89,8.89 97,7.78 v101.92,7.78
  Bottom 0.7: SW1.2 113.03,17.46 v109.54,13.97 | v101.92,7.78 104.14,10 LED2.A
N$24
  Bottom 0.7: SW1.1 108.9,17.78 104.3,13.18 100.17,13.18 97.79,10.79 LED1.A
N$25
  Bottom 0.7: BACK_LIGHT.1 54.93,17.78 48.1,10.95 48.1,10.48 LCD1.15 J1.15
N$26
  pour Bottom (isolate 0.61): 0,100.33 0,0 151.13,0 151.13,100.33
N$27
  Bottom 0.7: SW5.14 87.63,73.34 89.53,71.44 115.25,71.44 118.75,74.93 S14.2 118.9,75.25 118.9,81.28 S10.2 118.9,81.6 118.9,87.63 S6.2 118.9,87.95 118.9,93.98 S2.2
N$28
  Bottom 0.7: R5.P$2 U$2.3
N$29
  Bottom 0.7: POT2.S A.2
N$30  (via drill 0.6)
  Top 0.7: v94.14,77.95 94.77,77.95 96.04,79.22 v122.08,79.22
  Bottom 0.7: SW5.15 90.17,73.98 v94.14,77.95 | v122.08,79.22 129.38,79.22 131.44,81.28 S11.2 | S15.2 131.44,74.93 131.44,80.8 S11.2 | S11.2 131.6,81.6 131.6,87.63 S7.2 131.6,87.95 131.6,93.98 S3.2
N$31
  Bottom 0.7: SW5.9 74.93,73.98 94.93,93.98 S1.1 99.85,94.14 101.6,95.89 107.79,95.89 109.7,93.98 S2.1 112.55,94.14 114.3,95.89 120.49,95.89 122.4,93.98 S3.1 125.25,94.14 127,95.89 133.19,95.89 135.1,93.98 S4.1
N$33
  Bottom 0.7: D1.C 135.89,39.37 IC2.IN
N$34  (via drill 0.6)
  Top 0.7: v109.38,73.34 110.17,73.34 110.49,73.03 v134.78,73.03
  Bottom 0.7: SW5.16 97.31,73.66 97.95,73.03 109.06,73.03 v109.38,73.34 | v134.78,73.03 142.24,73.03 144.15,74.93 S16.2 144.3,75.25 144.3,81.28 S12.2 144.3,81.6 144.3,87.63 S8.2 144.3,87.95 144.3,93.98 S4.2
N$35  (via drill 0.6)
  Top 0.7: v108.58,27.78 128.91,27.78 129.38,27.3 132.24,27.3 132.72,27.78 132.72,41.91 127.16,47.47 104.78,47.47 v102.87,45.56
  Bottom 0.7: Q1.1 97.95,27.94 99.54,29.53 106.84,29.53 v108.58,27.78 | IC1.12 v102.87,45.56
N$37
  pour Top (isolate 0.61): 0,100.33 151.13,100.33 151.13,0 0,0
N$39  (via drill 0.6)
  Top 0.7: v126.36,45.56 126.36,40.96 128.75,38.58 v128.75,31.27
  Bottom 0.7: LED9.K 130.33,49.53 v126.36,45.56 | R7.P$1 v128.75,31.27
N$41  (via drill 0.6)
  Top 0.7: v96.68,90.49 v109.38,90.49 v122.08,90.49 v134.78,90.49
  Bottom 0.7: SW5.10 77.47,73.98 91.12,87.63 96.68,87.63 | S5.1 96.68,87.63 | v109.38,90.49 112.24,87.63 S6.1 | 96.68,87.63 v96.68,90.49 | v122.08,90.49 124.94,87.63 S7.1 | v134.78,90.49 137.64,87.63 S8.1
N$49  (via drill 0.6)
  Top 0.7: v134.78,84.14 v122.08,84.14 v109.38,84.14 109.06,83.98 98.58,83.98 97.31,82.71 97.31,82.55 v96.04,81.28
  Bottom 0.7: SW5.11 80.01,73.98 87.31,81.28 v96.04,81.28 S9.1 | v109.38,84.14 112.24,81.28 S10.1 | v122.08,84.14 124.94,81.28 S11.1 | v134.78,84.14 137.64,81.28 S12.1
N$57  (via drill 0.6)
  Top 0.7: v96.68,77.15 v109.38,77.15 109.7,76.99 122.08,76.99 | v134.46,76.52 133.67,76.52 133.19,76.99 122.08,76.99 | v122.08,76.68 122.08,76.99
  Bottom 0.7: S13.1 98.9,74.93 v96.68,77.15 | v109.38,77.15 110.01,77.15 112.24,74.93 S14.1 | S16.1 136.05,74.93 v134.46,76.52 | SW5.12 82.55,73.34 85.57,70.33 120.33,70.33 124.94,74.93 S15.1 124.14,74.61 v122.08,76.68
POT1
  Bottom 0.7: POT1.S 10.16,18.73 17.46,11.43 17.46,10.48 LCD1.3 17.62,10.16 J1.3
RESET  (via drill 0.6)
  Top 0.7: v97.63,35.4 v97.63,23.02
  Bottom 0.7: 95.25,35.4 95.25,33.66 94.61,33.02 S17.1 | 95.25,35.4 IC1.9 | v97.63,23.02 U$1.5 | 95.25,35.4 v97.63,35.4
RRR  (via drill 0.6)
  Top 0.7: v14.61,27.46 14.61,23.97 15.08,23.5 15.08,20.64 v10.32,15.88
  Bottom 0.7: SW3.4 17.78,22.54 14.61,25.72 v14.61,27.46 | v10.32,15.88 13.34,12.86 13.49,12.86 14.92,11.43 14.92,10.48 LCD1.2 15.08,10.16 J1.2

### Text on the board
Top: A0-POT | A0 | ANALOG | 1/8/2018 | BY / SROUR / for HTI summer training | KEYPAD | 5V | GND | GND | 5V | PORTA | PORTC | POWER | 7SEG | PORTB | PORTD | RESET | LCD | BL | 12V | GND | 5V